# EAGLE design Braille V1 (EAGLE 9.6.2)
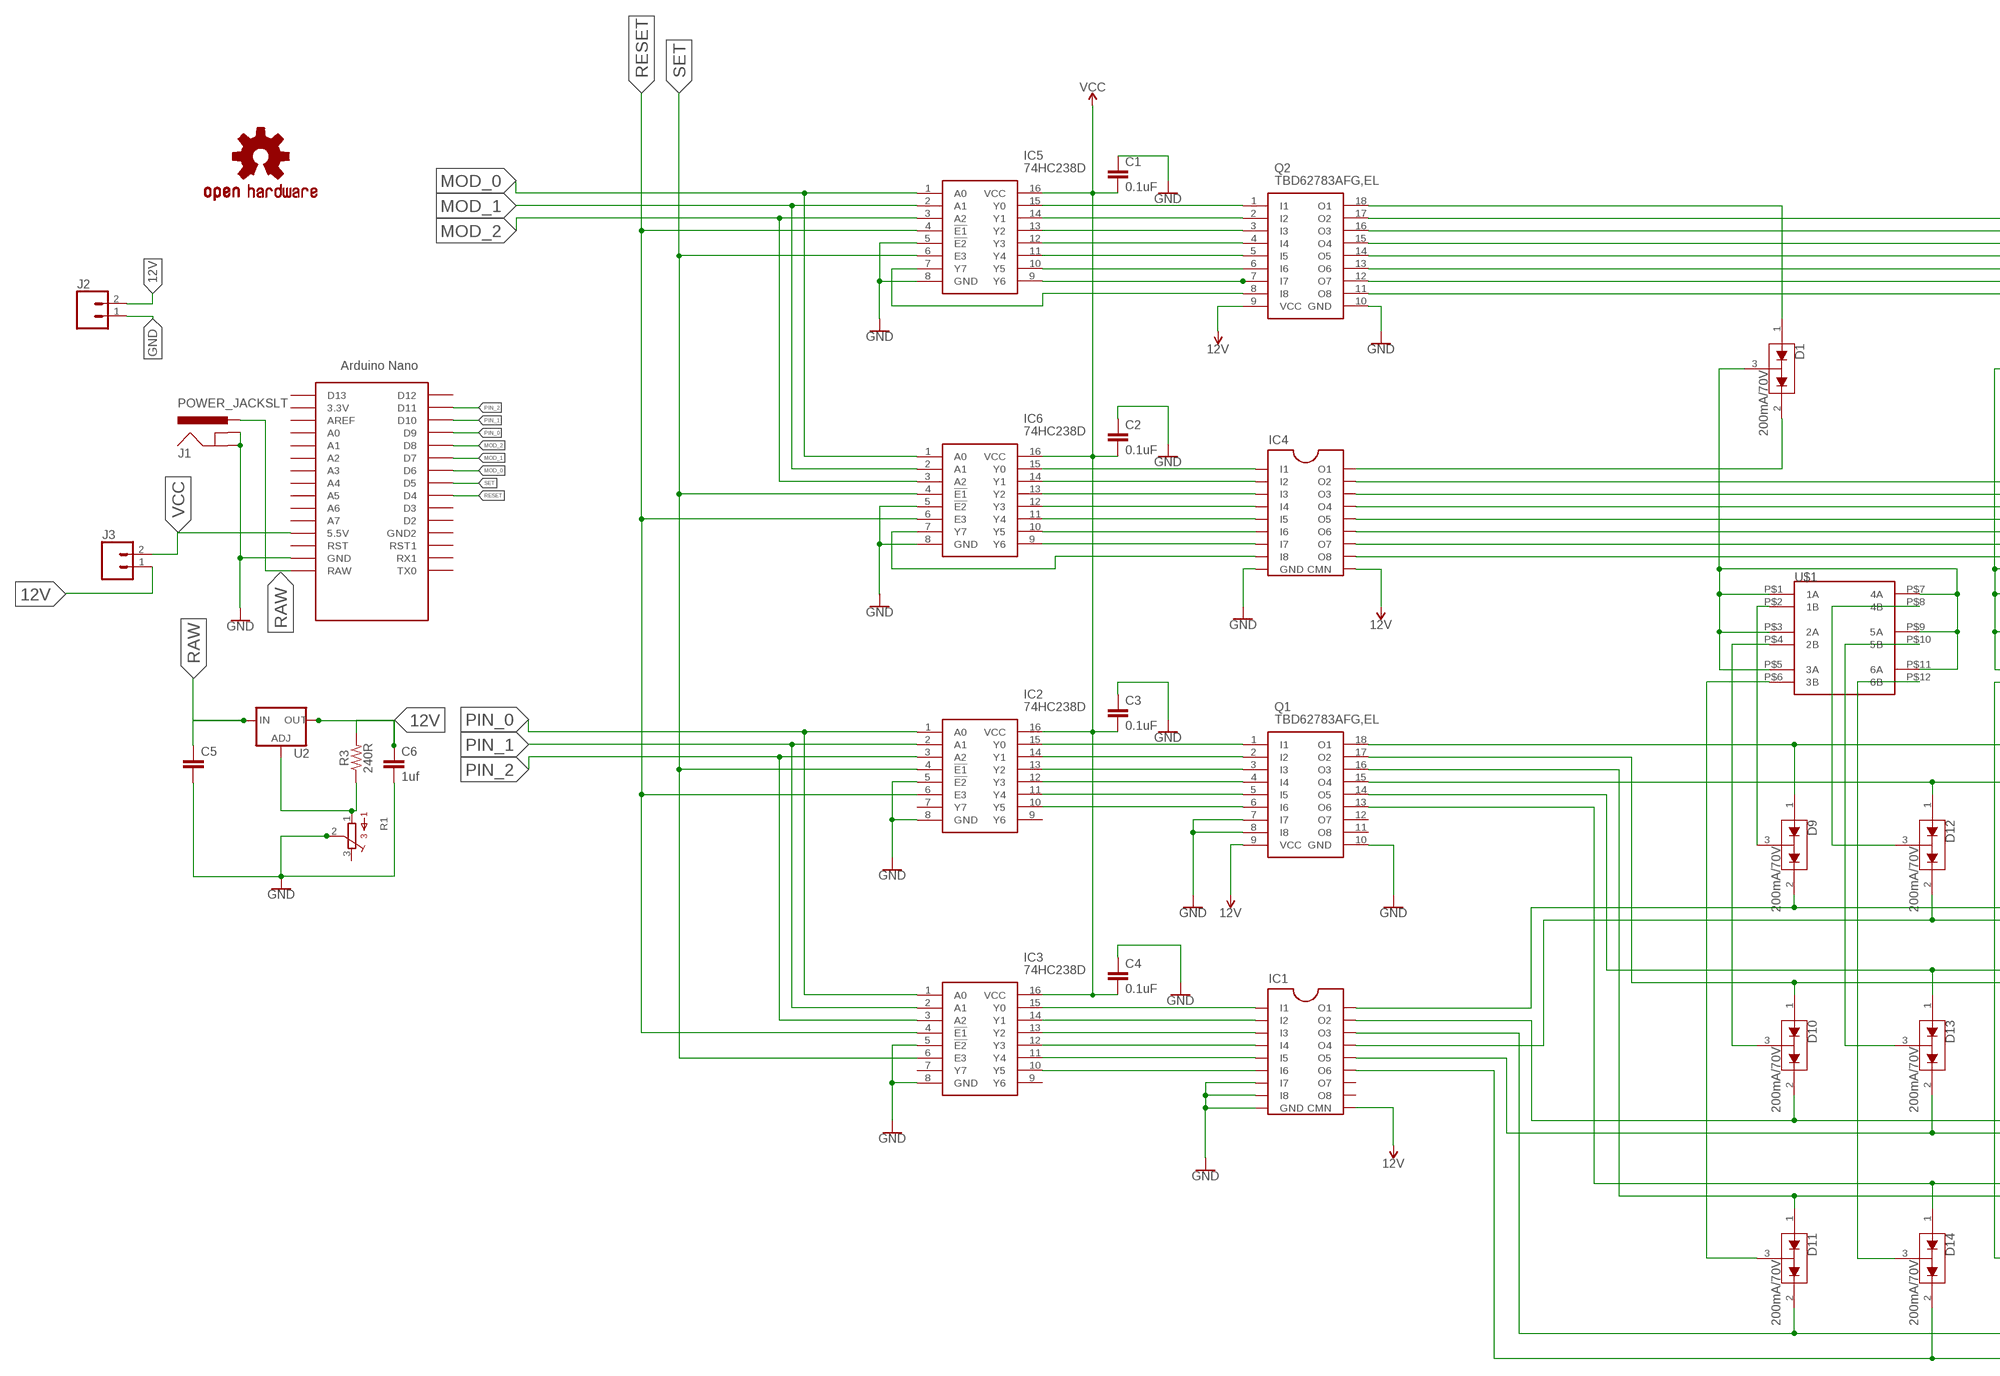
[diagram p0: schematic, sheet 1, part 1 of 2]
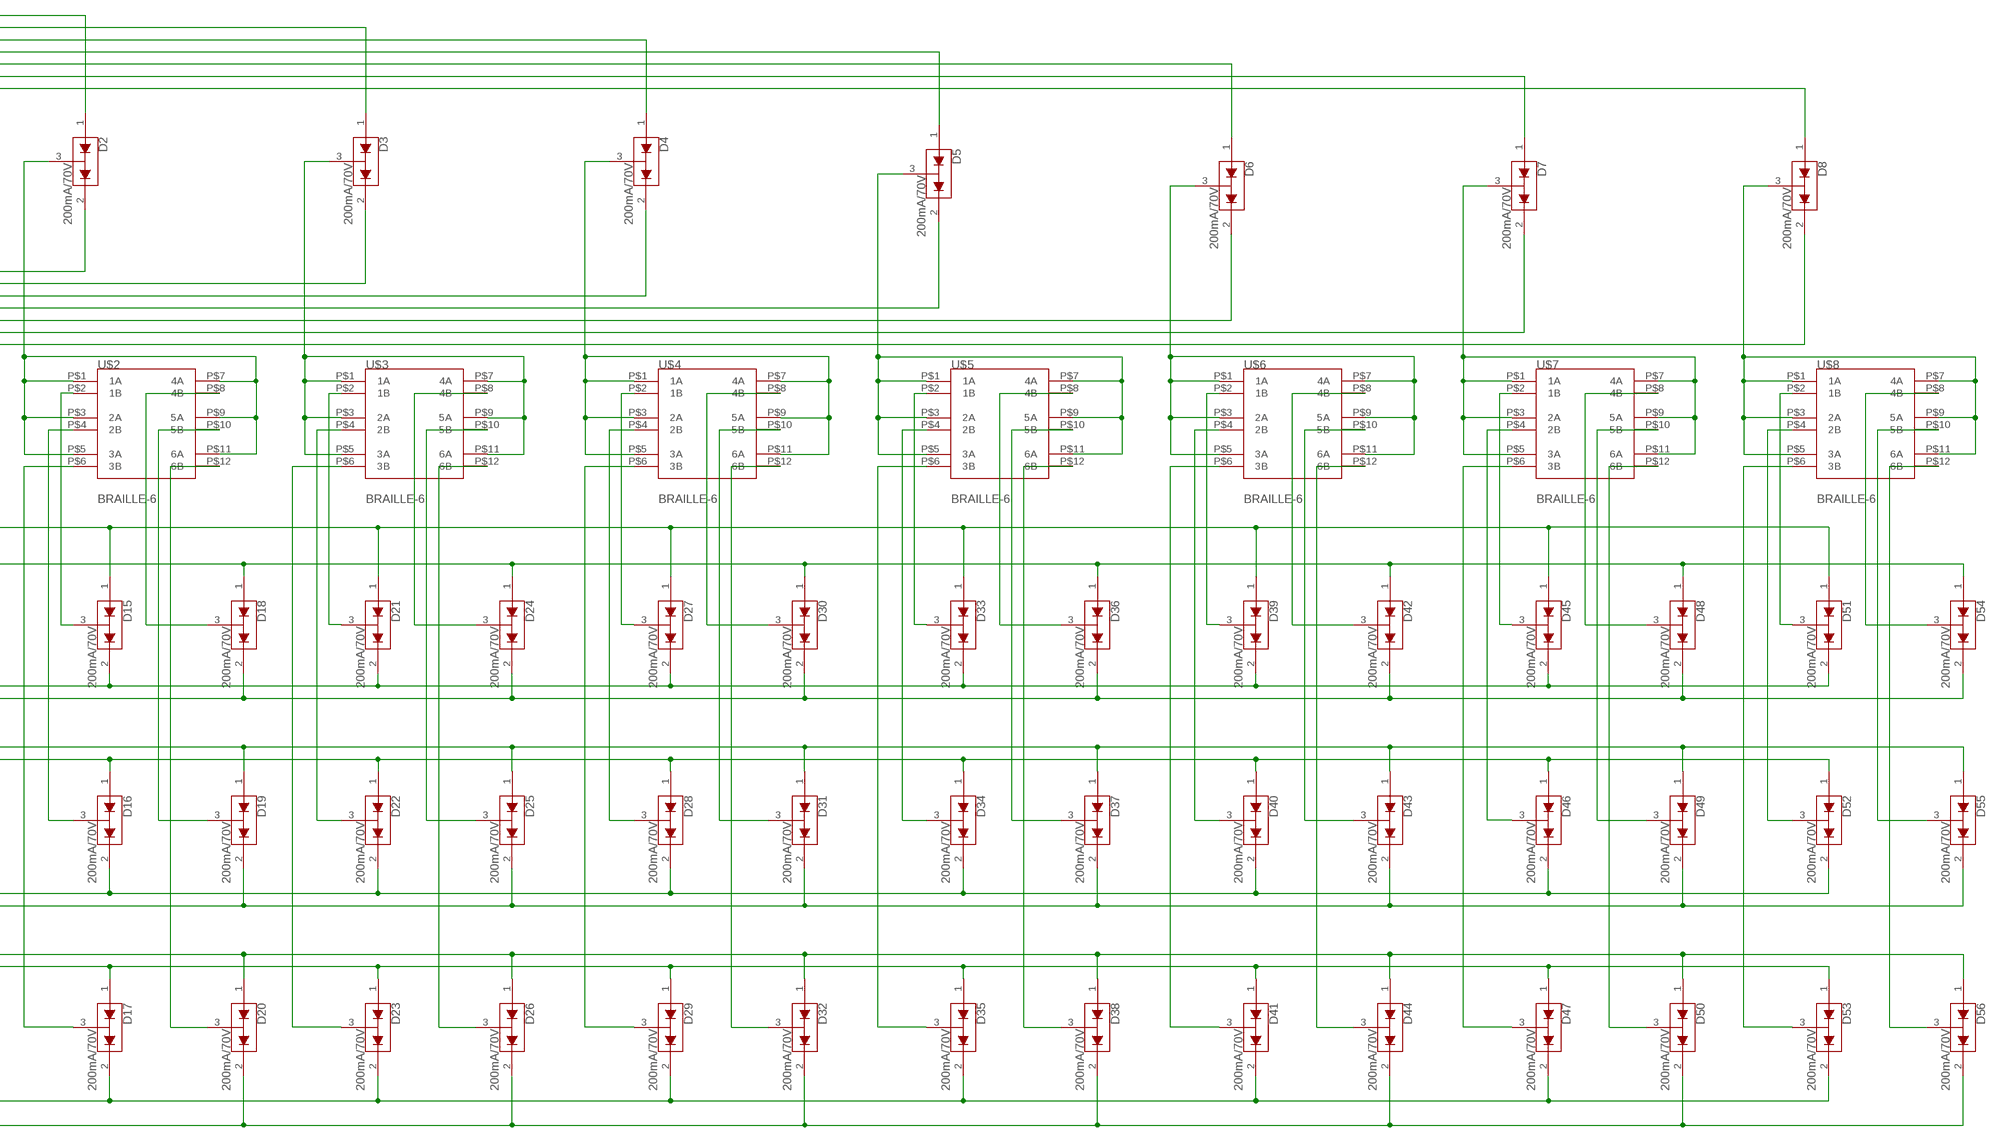
[diagram p1: schematic, sheet 1, part 2 of 2]

## Parts
C1  0.1uF  0.1UF-0603-25V-(+80/-20%)  [0603]
C2  0.1uF  0.1UF-0603-25V-(+80/-20%)  [0603]
C3  0.1uF  0.1UF-0603-25V-(+80/-20%)  [0603]
C4  0.1uF  0.1UF-0603-25V-(+80/-20%)  [0603]
C5  0.1uF  9.0PF-0603-50V-10%  [0603]
C6  1uf  9.0PF-0603-50V-10%  [0603]
D1  200mA/70V  BAV99  [SOT23-3]
D2  200mA/70V  BAV99  [SOT23-3]
D3  200mA/70V  BAV99  [SOT23-3]
D4  200mA/70V  BAV99  [SOT23-3]
D5  200mA/70V  BAV99  [SOT23-3]
D6  200mA/70V  BAV99  [SOT23-3]
D7  200mA/70V  BAV99  [SOT23-3]
D8  200mA/70V  BAV99  [SOT23-3]
D9  200mA/70V  BAV99  [SOT23-3]
D10  200mA/70V  BAV99  [SOT23-3]
D11  200mA/70V  BAV99  [SOT23-3]
D12  200mA/70V  BAV99  [SOT23-3]
D13  200mA/70V  BAV99  [SOT23-3]
D14  200mA/70V  BAV99  [SOT23-3]
D15  200mA/70V  BAV99  [SOT23-3]
D16  200mA/70V  BAV99  [SOT23-3]
D17  200mA/70V  BAV99  [SOT23-3]
D18  200mA/70V  BAV99  [SOT23-3]
D19  200mA/70V  BAV99  [SOT23-3]
D20  200mA/70V  BAV99  [SOT23-3]
D21  200mA/70V  BAV99  [SOT23-3]
D22  200mA/70V  BAV99  [SOT23-3]
D23  200mA/70V  BAV99  [SOT23-3]
D24  200mA/70V  BAV99  [SOT23-3]
D25  200mA/70V  BAV99  [SOT23-3]
D26  200mA/70V  BAV99  [SOT23-3]
D27  200mA/70V  BAV99  [SOT23-3]
D28  200mA/70V  BAV99  [SOT23-3]
D29  200mA/70V  BAV99  [SOT23-3]
D30  200mA/70V  BAV99  [SOT23-3]
D31  200mA/70V  BAV99  [SOT23-3]
D32  200mA/70V  BAV99  [SOT23-3]
D33  200mA/70V  BAV99  [SOT23-3]
D34  200mA/70V  BAV99  [SOT23-3]
D35  200mA/70V  BAV99  [SOT23-3]
D36  200mA/70V  BAV99  [SOT23-3]
D37  200mA/70V  BAV99  [SOT23-3]
D38  200mA/70V  BAV99  [SOT23-3]
D39  200mA/70V  BAV99  [SOT23-3]
D40  200mA/70V  BAV99  [SOT23-3]
D41  200mA/70V  BAV99  [SOT23-3]
D42  200mA/70V  BAV99  [SOT23-3]
D43  200mA/70V  BAV99  [SOT23-3]
D44  200mA/70V  BAV99  [SOT23-3]
D45  200mA/70V  BAV99  [SOT23-3]
D46  200mA/70V  BAV99  [SOT23-3]
D47  200mA/70V  BAV99  [SOT23-3]
D48  200mA/70V  BAV99  [SOT23-3]
D49  200mA/70V  BAV99  [SOT23-3]
D50  200mA/70V  BAV99  [SOT23-3]
D51  200mA/70V  BAV99  [SOT23-3]
D52  200mA/70V  BAV99  [SOT23-3]
D53  200mA/70V  BAV99  [SOT23-3]
D54  200mA/70V  BAV99  [SOT23-3]
D55  200mA/70V  BAV99  [SOT23-3]
D56  200mA/70V  BAV99  [SOT23-3]
IC1  TD62083  [SO18]
IC2  74HC238D  [SOIC127P600X175-16N]
IC3  74HC238D  [SOIC127P600X175-16N]
IC4  TD62083  [SO18]
IC5  74HC238D  [SOIC127P600X175-16N]
IC6  74HC238D  [SOIC127P600X175-16N]
J1  POWER_JACKSLT  [POWER_JACK_SLOT]
J2  CONN_02  [1X02]
J3  CONN_02  [1X02]
LOGO1  OSHW-LOGOL-COPPER  [OSHW-LOGO-L_COPPER]
Q1  TBD62783AFG,EL  [SOIC127P1030X245-18N]
Q2  TBD62783AFG,EL  [SOIC127P1030X245-18N]
R1  3362P  [3362P]
R3  240R  RESISTOR0603  [0603]
U2  LM317  V_REG_317SMD  [SOT223]
U$1  BRAILLE-6  [BRAILLE-6]
U$2  BRAILLE-6  [BRAILLE-6]
U$3  BRAILLE-6  [BRAILLE-6]
U$4  BRAILLE-6  [BRAILLE-6]
U$5  BRAILLE-6  [BRAILLE-6]
U$6  BRAILLE-6  [BRAILLE-6]
U$7  BRAILLE-6  [BRAILLE-6]
U$8  BRAILLE-6  [BRAILLE-6]
U$9  NANO  [NANO]

## Nets
12V: C6.1 IC1.10(CMN) IC4.10(CMN) J2.2 J3.1 Q1.9(VCC) Q2.9(VCC) R3.2 U2.2(OUT)
GND: C1.1 C2.1 C3.1 C4.1 C5.2 C6.2 IC1.7(I7) IC1.8(I8) IC1.9(GND) IC2.5(!E2) IC2.8(GND) IC3.5(!E2) IC3.8(GND) IC4.9(GND) IC5.5(!E2) IC5.8(GND) IC6.5(!E2) IC6.8(GND) J1.GND@1(GNDBREAK) J1.GND@2(GND) J2.1 Q1.7(I7) Q1.8(I8) Q1.10(GND) Q2.10(GND) R1.2 U$9.GND
MOD_0: IC5.1(A0) IC6.1(A0) U$9.D6
MOD_1: IC5.2(A1) IC6.2(A1) U$9.D7
MOD_2: IC5.3(A2) IC6.3(A2) U$9.D8
N$1: IC2.15(Y0) Q1.1(I1)
N$2: IC2.14(Y1) Q1.2(I2)
N$3: IC2.13(Y2) Q1.3(I3)
N$4: IC2.12(Y3) Q1.4(I4)
N$5: IC2.11(Y4) Q1.5(I5)
N$6: IC2.10(Y5) Q1.6(I6)
N$7: IC1.1(I1) IC3.15(Y0)
N$8: IC1.2(I2) IC3.14(Y1)
N$9: IC1.3(I3) IC3.13(Y2)
N$10: IC1.4(I4) IC3.12(Y3)
N$11: IC1.5(I5) IC3.11(Y4)
N$12: IC5.15(Y0) Q2.1(I1)
N$13: IC5.14(Y1) Q2.2(I2)
N$14: IC5.13(Y2) Q2.3(I3)
N$15: IC5.12(Y3) Q2.4(I4)
N$16: IC5.11(Y4) Q2.5(I5)
N$17: D1.1(A1) Q2.18(O1)
N$18: IC4.1(I1) IC6.15(Y0)
N$19: IC4.2(I2) IC6.14(Y1)
N$20: IC4.3(I3) IC6.13(Y2)
N$21: IC4.4(I4) IC6.12(Y3)
N$22: IC4.5(I5) IC6.11(Y4)
N$23: D2.1(A1) Q2.17(O2)
N$24: IC5.10(Y5) Q2.6(I6)
N$25: D3.1(A1) Q2.16(O3)
N$26: IC5.9(Y6) Q2.7(I7)
N$27: IC5.7(Y7) Q2.8(I8)
N$28: IC4.8(I8) IC6.7(Y7)
N$29: IC4.6(I6) IC6.10(Y5)
N$30: IC4.7(I7) IC6.9(Y6)
N$31: D4.1(A1) Q2.15(O4)
N$32: IC1.6(I6) IC3.10(Y5)
N$33: D5.1(A1) Q2.14(O5)
N$34: D6.1(A1) Q2.13(O6)
N$35: D7.1(A1) Q2.12(O7)
N$36: D8.1(A1) Q2.11(O8)
N$37: D1.2(C2) IC4.18(O1)
N$38: D9.3(COM) U$1.P$2(1B)
N$39: D2.2(C2) IC4.17(O2)
N$40: D3.3(COM) U$3.P$1(1A) U$3.P$3(2A) U$3.P$5(3A) U$3.P$7(4A) U$3.P$9(5A) U$3.P$11(6A)
N$41: D4.3(COM) U$4.P$1(1A) U$4.P$3(2A) U$4.P$5(3A) U$4.P$7(4A) U$4.P$9(5A) U$4.P$11(6A)
N$42: D5.3(COM) U$5.P$1(1A) U$5.P$3(2A) U$5.P$5(3A) U$5.P$7(4A) U$5.P$9(5A) U$5.P$11(6A)
N$43: D6.3(COM) U$6.P$1(1A) U$6.P$3(2A) U$6.P$5(3A) U$6.P$7(4A) U$6.P$9(5A) U$6.P$11(6A)
N$44: D7.3(COM) U$7.P$1(1A) U$7.P$3(2A) U$7.P$5(3A) U$7.P$7(4A) U$7.P$9(5A) U$7.P$11(6A)
N$45: D8.3(COM) U$8.P$1(1A) U$8.P$3(2A) U$8.P$5(3A) U$8.P$7(4A) U$8.P$9(5A) U$8.P$11(6A)
N$46: D10.3(COM) U$1.P$4(2B)
N$47: D11.3(COM) U$1.P$6(3B)
N$48: D12.3(COM) U$1.P$8(4B)
N$49: D13.3(COM) U$1.P$10(5B)
N$50: D14.3(COM) U$1.P$12(6B)
N$51: D21.3(COM) U$3.P$2(1B)
N$52: D10.1(A1) D16.1(A1) D22.1(A1) D28.1(A1) D34.1(A1) D40.1(A1) D46.1(A1) D52.1(A1) Q1.17(O2)
N$53: D11.1(A1) D17.1(A1) D23.1(A1) D29.1(A1) D35.1(A1) D41.1(A1) D47.1(A1) D53.1(A1) Q1.16(O3)
N$54: D12.1(A1) D18.1(A1) D24.1(A1) D30.1(A1) D36.1(A1) D42.1(A1) D48.1(A1) D54.1(A1) Q1.15(O4)
N$55: D27.3(COM) U$4.P$2(1B)
N$56: D33.3(COM) U$5.P$2(1B)
N$57: D9.2(C2) D15.2(C2) D21.2(C2) D27.2(C2) D33.2(C2) D39.2(C2) D45.2(C2) D51.2(C2) IC1.18(O1)
N$58: D39.3(COM) U$6.P$2(1B)
N$59: D11.2(C2) D17.2(C2) D23.2(C2) D29.2(C2) D35.2(C2) D41.2(C2) D47.2(C2) D53.2(C2) IC1.16(O3)
N$60: D12.2(C2) D18.2(C2) D24.2(C2) D30.2(C2) D36.2(C2) D42.2(C2) D48.2(C2) D54.2(C2) IC1.15(O4)
N$61: D13.2(C2) D19.2(C2) D25.2(C2) D31.2(C2) D37.2(C2) D43.2(C2) D49.2(C2) D55.2(C2) IC1.14(O5)
N$62: D14.2(C2) D20.2(C2) D26.2(C2) D32.2(C2) D38.2(C2) D44.2(C2) D50.2(C2) D56.2(C2) IC1.13(O6)
N$63: D15.3(COM) U$2.P$2(1B)
N$64: D16.3(COM) U$2.P$4(2B)
N$65: D17.3(COM) U$2.P$6(3B)
N$66: D18.3(COM) U$2.P$8(4B)
N$67: D19.3(COM) U$2.P$10(5B)
N$68: D20.3(COM) U$2.P$12(6B)
N$69: D28.3(COM) U$4.P$4(2B)
N$70: D22.3(COM) U$3.P$4(2B)
N$71: D23.3(COM) U$3.P$6(3B)
N$72: D24.3(COM) U$3.P$8(4B)
N$73: D25.3(COM) U$3.P$10(5B)
N$74: D26.3(COM) U$3.P$12(6B)
N$75: D45.3(COM) U$7.P$2(1B)
N$76: D10.2(C2) D16.2(C2) D22.2(C2) D28.2(C2) D34.2(C2) D40.2(C2) D46.2(C2) D52.2(C2) IC1.17(O2)
N$77: D51.3(COM) U$8.P$2(1B)
N$78: D1.3(COM) U$1.P$1(1A) U$1.P$3(2A) U$1.P$5(3A) U$1.P$7(4A) U$1.P$9(5A) U$1.P$11(6A)
N$79: D2.3(COM) U$2.P$1(1A) U$2.P$3(2A) U$2.P$5(3A) U$2.P$7(4A) U$2.P$9(5A) U$2.P$11(6A)
N$80: D29.3(COM) U$4.P$6(3B)
N$81: D30.3(COM) U$4.P$8(4B)
N$82: D3.2(C2) IC4.16(O3)
N$83: D13.1(A1) D19.1(A1) D25.1(A1) D31.1(A1) D37.1(A1) D43.1(A1) D49.1(A1) D55.1(A1) Q1.14(O5)
N$84: D14.1(A1) D20.1(A1) D26.1(A1) D32.1(A1) D38.1(A1) D44.1(A1) D50.1(A1) D56.1(A1) Q1.13(O6)
N$85: D4.2(C2) IC4.15(O4)
N$86: D5.2(C2) IC4.14(O5)
N$87: D6.2(C2) IC4.13(O6)
N$88: D7.2(C2) IC4.12(O7)
N$89: D8.2(C2) IC4.11(O8)
N$91: D31.3(COM) U$4.P$10(5B)
N$92: D32.3(COM) U$4.P$12(6B)
N$93: R1.1 R3.1 U2.1(ADJ)
N$103: D34.3(COM) U$5.P$4(2B)
N$104: D35.3(COM) U$5.P$6(3B)
N$105: D36.3(COM) U$5.P$8(4B)
N$106: D37.3(COM) U$5.P$10(5B)
N$107: D38.3(COM) U$5.P$12(6B)
N$118: D40.3(COM) U$6.P$4(2B)
N$119: D41.3(COM) U$6.P$6(3B)
N$120: D42.3(COM) U$6.P$8(4B)
N$121: D43.3(COM) U$6.P$10(5B)
N$122: D44.3(COM) U$6.P$12(6B)
N$133: D46.3(COM) U$7.P$4(2B)
N$134: D47.3(COM) U$7.P$6(3B)
N$135: D48.3(COM) U$7.P$8(4B)
N$136: D49.3(COM) U$7.P$10(5B)
N$137: D50.3(COM) U$7.P$12(6B)
N$148: D52.3(COM) U$8.P$4(2B)
N$149: D53.3(COM) U$8.P$6(3B)
N$150: D54.3(COM) U$8.P$8(4B)
N$151: D55.3(COM) U$8.P$10(5B)
N$152: D56.3(COM) U$8.P$12(6B)
N$153: D9.1(A1) D15.1(A1) D21.1(A1) D27.1(A1) D33.1(A1) D39.1(A1) D45.1(A1) D51.1(A1) Q1.18(O1)
PIN_0: IC2.1(A0) IC3.1(A0) U$9.D9
PIN_1: IC2.2(A1) IC3.2(A1) U$9.D10
PIN_2: IC2.3(A2) IC3.3(A2) U$9.D11
RAW: C5.1 J1.PWR U2.3(IN) U$9.RAW
RESET: IC2.6(E3) IC3.4(!E1) IC5.4(!E1) IC6.6(E3) U$9.D4
SET: IC2.4(!E1) IC3.6(E3) IC5.6(E3) IC6.4(!E1) U$9.D5
VCC: C1.2 C2.2 C3.2 C4.2 IC2.16(VCC) IC3.16(VCC) IC5.16(VCC) IC6.16(VCC) J3.2 U$9.5V(5.5V)
Unconnected: IC1.11(O8) IC1.12(O7) IC2.7(Y7) IC2.9(Y6) IC3.7(Y7) IC3.9(Y6) Q1.11(O8) Q1.12(O7) R1.3 U$9.3.3V U$9.A0 U$9.A1 U$9.A2 U$9.A3 U$9.A4 U$9.A5 U$9.A6 U$9.A7 U$9.AREF U$9.D2 U$9.D3 U$9.D12 U$9.D13 U$9.GND1(GND2) U$9.ICSP1 U$9.ICSP2 U$9.ICSP3 U$9.ICSP4 U$9.ICSP5 U$9.ICSP6 U$9.RST U$9.RST1 U$9.RX1 U$9.TX0

## Library data of the parts
C1-C4 = SparkFun-Capacitors:0.1UF: 0.1µF ceramic capacitors A capacitor is a passive two-terminal electrical component used to store electrical energy temporarily in an electric field.; PROD_ID: CAP-00810
C5 C6 = SparkFun-Capacitors:9.0PF: 9.0pF ceramic capacitors A capacitor is a passive two-terminal electrical component used to store electrical energy temporarily in an electric field.; PROD_ID: CAP-09341; VALUE: 9.0pF
D1-D56 = SparkFun-DiscreteSemi:BAV99: Series-pair diode array Two small signal silicon diodes connected anode to cathode. Connections to all three nodes available. Link to datasheet <https://www.fairchildsemi.com/datasheets/BA/BAV99.pdf> SparkFun Products: SparkFun AutoDriver <https://www.sparkfun.com/products/13752>; PROD_ID: DIO-10647
IC1 IC4 = toshiba-td62083:TD62083: 8ch Darlington Sink Driver Source: http://akizukidenshi.com/download/TD62083AP.pdf
IC2 IC3 IC5 IC6 = 74HC238D:74HC238D: Codeurs, dcodeurs, multiplexeurs et dmultiplexeurs 3-TO-8 DECODER DEMULTIPLEXER Source: Datasheet <https://assets.nexperia.com/documents/data-sheet/74HC_HCT238.pdf>; DESCRIPTION: Codeurs, dcodeurs, multiplexeurs et dmultiplexeurs 3-TO-8 DECODER DEMULTIPLEXER; HEIGHT: 1.75mm; MANUFACTURER_NAME: Nexperia; MANUFACTURER_PART_NUMBER: 74HC238D; MOUSER_PART_NUMBER: 771-74HC238D; MOUSER_PRICE-STOCK: https://www.mouser.co.uk/ProductDetail/Nexperia/74HC238D?qs=JTOGeJziEKGZLH3gr9jJBw%3D%3D
J1 = SparkFun-Connectors:POWER_JACK: Power Jack Connector This is the standard 5.5mm barrel jack for power. The PTH is the most common, proven, reliable, footprint. The Slot footprint only works if the mill layer is transmitted to the PCB fab house so be warned. Here are the connectors we sell at SparkFun: DC Barrel Power Jack/Connector <https://www.sparkfun.com/products/119> (PRT-00119) DC Barrel Power Jack/Connector (SMD) <https://www.sparkfun.com/products/12748> (PRT-12748) DC Barrel Jack Adapter - Breadboard Compatible <https://www.sparkfun.com/products/10811> (PRT-10811) It is used on this SparkFun product (and many, many others): SparkFun RedBoard - Programmed with Arduino <https://www.sparkfun.com/products/12757> (DEV-12757) Also, if you need a mating power supply or connector, please check these out: Wall Adapter Power Supply - 9VDC 650mA <https://www.sparkfun.com/products/298> (TOL-00298) DC Barrel Jack Adapter - Male <https://www.sparkfun.com/products/10287> (PRT-10287); PROD_ID: PRT-00119
J2 J3 = SparkFun-Connectors:CONN_02: Multi connection point. Often used as Generic Header-pin footprint for 0.1 inch spaced/style header connections On any of the 0.1 inch spaced packages, you can populate with these: Break Away Headers - Straight <https://www.sparkfun.com/products/116> (PRT-00116) Break Away Male Headers - Right Angle <https://www.sparkfun.com/products/553> (PRT-00553) Female Headers <https://www.sparkfun.com/products/115> (PRT-00115) Break Away Headers - Machine Pin <https://www.sparkfun.com/products/117> (PRT-00117) Break Away Female Headers - Swiss Machine Pin <https://www.sparkfun.com/products/743> (PRT-00743) For SCREWTERMINALS and SPRING TERMINALS visit here: Screw Terimnals on SparkFun.com <https://www.sparkfun.com/search/results?term=Screw+Terminals> (5mm/3.5mm/2.54mm spacing) This device is also useful as a general connection point to wire up your design to another part of your project. Our various solder wires solder well into these plated through hole pads. Hook-Up Wire - Assortment (Stranded, 22 AWG) <https://www.sparkfun.com/products/11375> (PRT-11375) Hook-Up Wire - Assortment (Solid Core, 22 AWG) <https://www.sparkfun.com/products/11367> (PRT-11367) View the entire wire category on our website here <https://www.sparkfun.com/categories/141> Special notes: Molex polarized connector foot print use with: PRT-08233 with associated crimp pins and housings. 2.54_SCREWTERM for use with PRT-10571. 3.5mm Screw Terminal footprints for PRT-08084 5mm Screw Terminal footprints for use with PRT-08432
LOGO1 = SparkFun-Aesthetics:OSHW-LOGO: Open-Source Hardware (OSHW) Logo This logo indicates the piece of hardware it is found on incorporates a OSHW license and/or adheres to the definition of open source hardware found here: http://freedomdefined.org/OSHW
Q1 Q2 = TBD62783AFG_EL:TBD62783AFG,EL: Gate Drivers DMOS Transistor Array8-CH, 50V/0.5A Source: Datasheet; DESCRIPTION: Gate Drivers DMOS Transistor Array8-CH, 50V/0.5A; HEIGHT: 2.45mm; MANUFACTURER_NAME: Toshiba; MANUFACTURER_PART_NUMBER: TBD62783AFG,EL; MOUSER_PART_NUMBER: 757-TBD62783AFGEL; MOUSER_PRICE-STOCK: https://www.mouser.co.uk/ProductDetail/Toshiba/TBD62783AFGEL?qs=fSnNYG2PaKJyPGRf9HI0JA%3D%3D
R1 = bourns:3362: 3362 Series 1/4" Square Trimmer
R3 = SparkFun-Resistors:RESISTOR: Generic Resistor Package
U2 = SparkFun-IC-Power:V_REG_317: Voltage Regulator Standard LM317 adjustable voltage regulator. AOI (Adjust Output Input). Google 'LM317 Calculator' for easy to use app to get the two resistor values needed. 240/720 for 5V output. 240/390 for 3.3V output. Spark Fun Electronics SKU : COM-00527
U$1-U$8 = Braille Cell:BRAILLE-6
U$9 = Arduino-clone:NANO: Arduino Nano

## Board
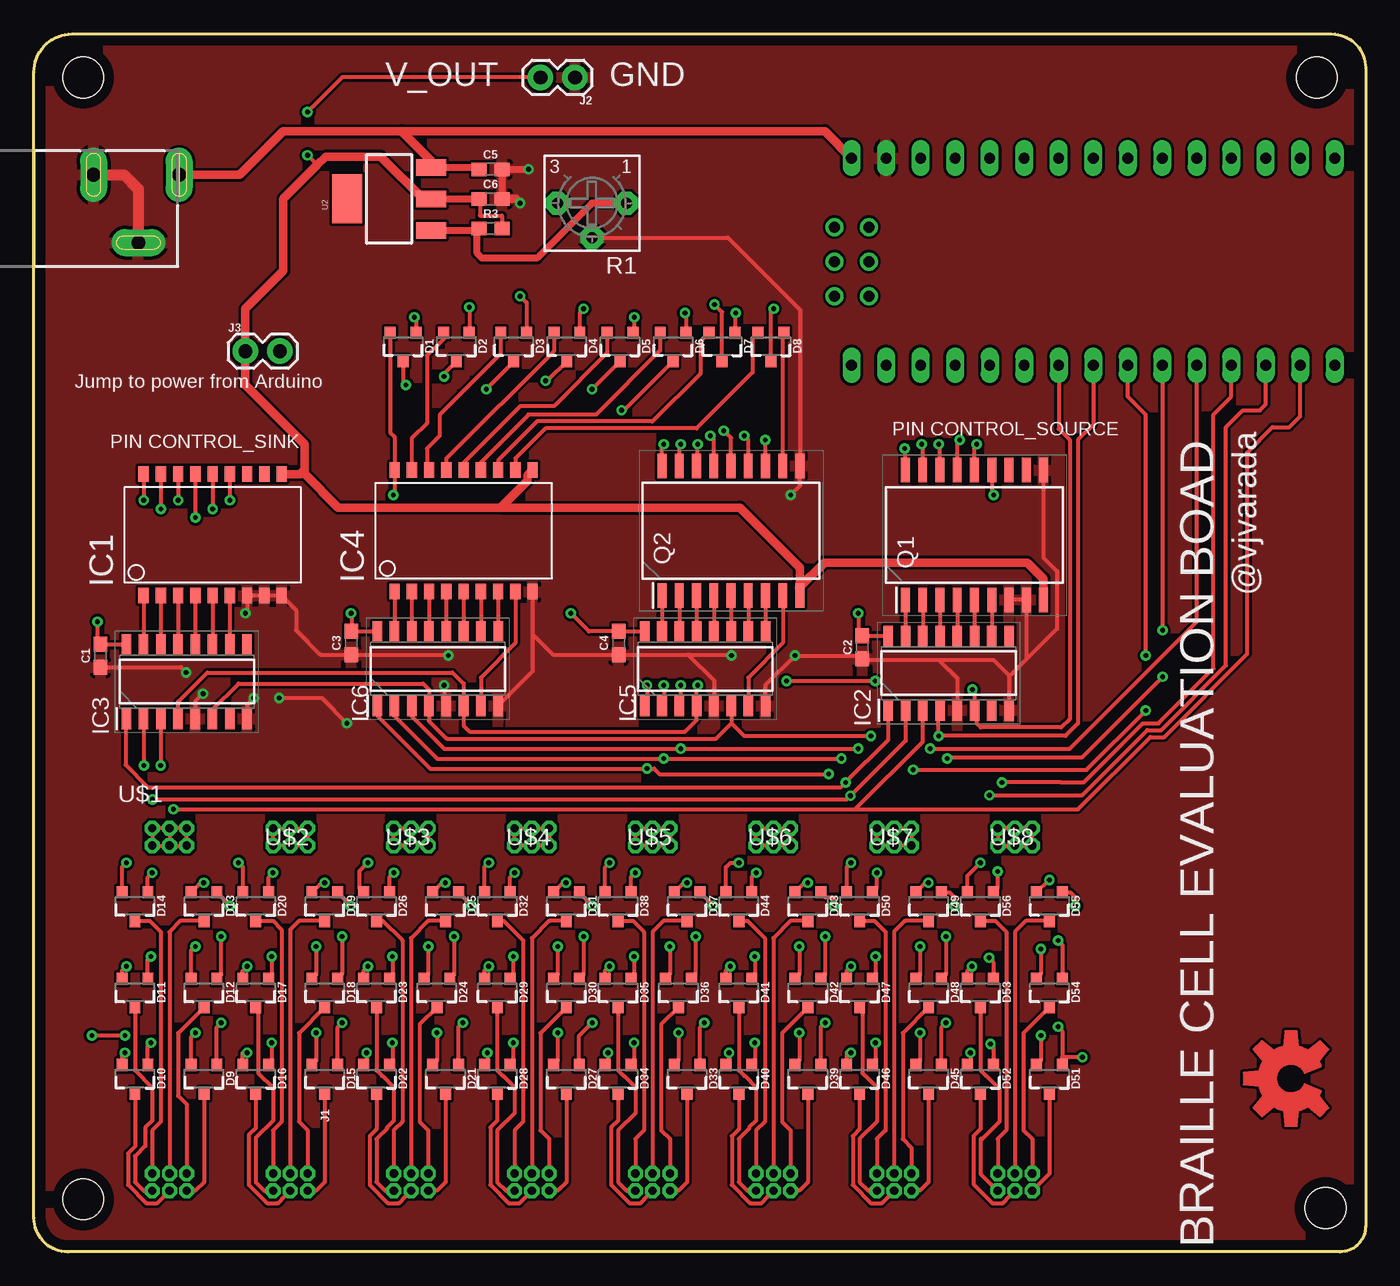
[diagram p2: board, top side]
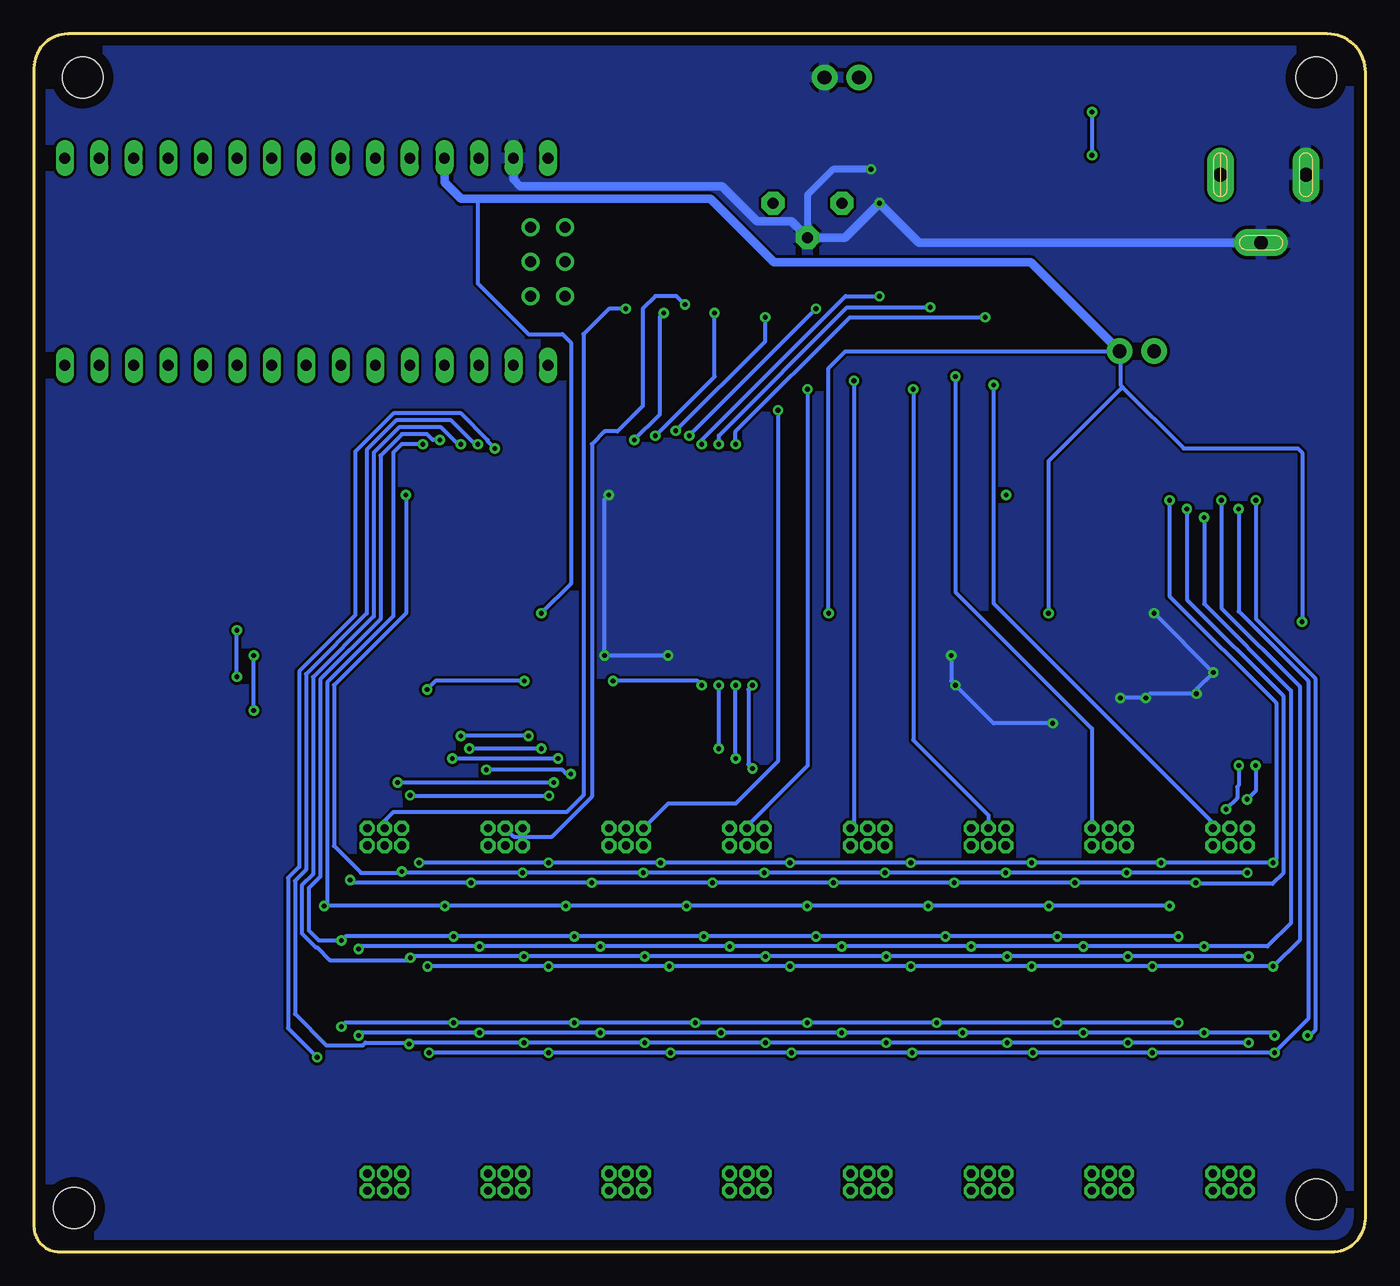
[diagram p3: board, bottom side, seen from below]

Size 98.01 x 89.61 mm. Coordinates in mm from the lower left corner, seen from the top.
Outline: 2.8,89.61 95.52,89.61 arc-90 98.01,87.12 98.01,1.87 arc-90 96.15,0 2.49,0 arc-90 0,2.49 0,86.81 arc-90 2.8,89.61
Copper layers (1*16): Top 0.035mm / dielectric 1.5mm / Bottom 0.035mm
Design rules "LionCircuits": minimum track width 8mil, minimum drill 0.35mm, track to track 8mil, track to pad 8mil, pad to pad 8mil, via to via 8mil, smd to smd 8mil, copper to edge 30mil, drill to drill 10mil, minimum pad ring 10mil, minimum via ring 8mil, stop-mask expansion 4mil, vias tented up to drill 0mil, thermal gap 10mil
Holes 3 mm at 3.63,86.41 3.63,3.86 95.07,3.23 94.43,86.41

### Footprints (pad centres in the part's own frame; a part is rotated, then mirrored left to right if it is on the bottom)
0603 = smd 1.1 x 1: 1 -0.85,0; 2 0.85,0
SOT23-3 = smd 0.8 x 0.9: 1 -0.95,-1; 2 0.95,-1; 3 0,1.1
SO18 = smd 0.762 x 1.143: 1 -5.08,-3.835; 2 -3.81,-3.835; 3 -2.54,-3.835; 4 -1.27,-3.835; 5 0,-3.835; 6 1.27,-3.835; 7 2.54,-3.835; 8 3.81,-3.835; 9 5.08,-3.835; 10 5.08,5.105; 11 3.81,5.105; 12 2.54,5.105; 13 1.27,5.105; 14 0,5.105; 15 -1.27,5.105; 16 -2.54,5.105; 17 -3.81,5.105; 18 -5.08,5.105
SOIC127P600X175-16N = smd 1.55 x 0.7: 1 -2.725,4.445; 2 -2.725,3.175; 3 -2.725,1.905; 4 -2.725,0.635; 5 -2.725,-0.635; 6 -2.725,-1.905; 7 -2.725,-3.175; 8 -2.725,-4.445; 9 2.725,-4.445; 10 2.725,-3.175; 11 2.725,-1.905; 12 2.725,-0.635; 13 2.725,0.635; 14 2.725,1.905; 15 2.725,3.175; 16 2.725,4.445
POWER_JACK_SLOT = drill 1 pad 2 long: GND@1 2.58,7.5; GND@2 7.58,10.8; PWR 2.58,13.8
1X02 = drill 1.016 pad 1.88: 1 0,0; 2 2.54,0
SOIC127P1030X245-18N = smd 1.8 x 0.65: 1 -4.775,5.08; 2 -4.775,3.81; 3 -4.775,2.54; 4 -4.775,1.27; 5 -4.775,0; 6 -4.775,-1.27; 7 -4.775,-2.54; 8 -4.775,-3.81; 9 -4.775,-5.08; 10 4.775,-5.08; 11 4.775,-3.81; 12 4.775,-2.54; 13 4.775,-1.27; 14 4.775,0; 15 4.775,1.27; 16 4.775,2.54; 17 4.775,3.81; 18 4.775,5.08
3362P = drill 0.813 pad 1.676 octagon: 1 -2.54,0; 2 0,2.54; 3 2.54,0
SOT223 = smd 1.219 x 2.235: 1 -2.311,-3.099; 2 0,-3.099; 3 2.311,-3.099 | smd 3.6 x 2.2: 4 0,3.099
BRAILLE-6 = drill 0.6 octagon: P$1 -1.27,13.335; P$2 1.27,-13.335; P$3 0,13.335; P$4 0,-13.335; P$5 1.27,13.335; P$6 -1.27,-13.335; P$7 -1.27,12.065; P$8 1.27,-12.065; P$9 0,12.065; P$10 0,-12.065; P$11 1.27,12.065; P$12 -1.27,-12.065
NANO = drill 0.8 long: 3.3V -10.16,24.13; 5V -10.16,-1.27; A0 -10.16,19.05; A1 -10.16,16.51; A2 -10.16,13.97; A3 -10.16,11.43; A4 -10.16,8.89; A5 -10.16,6.35; A6 -10.16,3.81; A7 -10.16,1.27; AREF -10.16,21.59; D2 5.08,1.27; D3 5.08,3.81; D4 5.08,6.35; D5 5.08,8.89; D6 5.08,11.43; D7 5.08,13.97; D8 5.08,16.51; D9 5.08,19.05; D10 5.08,21.59; D11 5.08,24.13; D12 5.08,26.67; D13 -10.16,26.67; GND -10.16,-6.35; GND1 5.08,-1.27; RAW -10.16,-8.89; RST -10.16,-3.81; RST1 5.08,-3.81; RX1 5.08,-6.35; TX0 5.08,-8.89 | drill 0.8: ICSP1 -5.08,-10.16; ICSP2 -5.08,-7.62; ICSP3 -2.54,-10.16; ICSP4 -2.54,-7.62; ICSP5 0,-10.16; ICSP6 0,-7.62

### Placement (x,y rotation side)
C1  4.9,43.87 90 top
C2  60.97,44.49 90 top
C3  23.36,44.8 90 top
C4  43.04,44.8 90 top
C5  33.6,79.65 0 top
C6  33.6,77.48 0 top
D1  27.18,66.64 180 top
D2  31.09,66.64 180 top
D3  35.31,66.64 180 top
D4  39.22,66.64 180 top
D5  43.14,66.64 180 top
D6  47.05,66.64 180 top
D7  50.65,66.64 180 top
D8  54.25,66.64 180 top
D9  12.52,12.75 180 top
D10  7.44,12.75 180 top
D11  7.44,19.1 180 top
D12  12.52,19.1 180 top
D13  12.52,25.45 180 top
D14  7.44,25.45 180 top
D15  21.41,12.75 180 top
D16  16.33,12.75 180 top
D17  16.33,19.1 180 top
D18  21.41,19.1 180 top
D19  21.41,25.45 180 top
D20  16.33,25.45 180 top
D21  30.3,12.75 180 top
D22  25.22,12.75 180 top
D23  25.22,19.1 180 top
D24  29.66,19.1 180 top
D25  30.3,25.45 180 top
D26  25.22,25.45 180 top
D27  39.19,12.75 180 top
D28  34.11,12.75 180 top
D29  34.11,19.1 180 top
D30  39.19,19.1 180 top
D31  39.19,25.45 180 top
D32  34.11,25.45 180 top
D33  48.08,12.75 180 top
D34  43,12.75 180 top
D35  43,19.1 180 top
D36  47.44,19.1 180 top
D37  48.08,25.45 180 top
D38  43,25.45 180 top
D39  56.97,12.75 180 top
D40  51.89,12.75 180 top
D41  51.89,19.1 180 top
D42  56.97,19.1 180 top
D43  56.97,25.45 180 top
D44  51.89,25.45 180 top
D45  65.86,12.75 180 top
D46  60.78,12.75 180 top
D47  60.78,19.1 180 top
D48  65.86,19.1 180 top
D49  65.86,25.45 180 top
D50  60.78,25.45 180 top
D51  74.75,12.75 180 top
D52  69.67,12.75 180 top
D53  69.67,19.1 180 top
D54  74.75,19.1 180 top
D55  74.75,25.45 180 top
D56  69.67,25.45 180 top
IC1  13.15,52.12 0 top
IC2  67.32,42.58 90 top
IC3  11.25,41.96 90 top
IC4  31.62,52.42 0 top
IC5  49.4,42.89 90 top
IC6  29.72,42.89 90 top
J1  -3.11,81.83 270 top
J2  39.82,86.41 180 top
J3  15.56,66.27 0 top
LOGO1  92.53,12.75 90 top
Q1  69.23,52.74 90 top
Q2  51.31,53.05 90 top
R1  41.07,77.17 180 top
R3  33.6,75.3 0 top
U2  26.14,77.48 90 top
U$1  9.98,17.83 0 top
U$2  18.87,17.83 0 top
U$3  27.76,17.83 0 top
U$4  36.65,17.83 0 top
U$5  45.54,17.83 0 top
U$6  54.43,17.83 0 top
U$7  63.32,17.83 0 top
U$8  72.21,17.83 0 top
U$9  69.08,70.32 270 top

### Tracks (layer width: path | path; a pad name or v marks a point on that pad's centre or on a via)
12V  (via drill 0.35)
  Top 0.305: 56.39,48.95 Q2.9 56.39,48.85 56.32,48.85 | C6.1 32.84,77.48 32.84,76.25 34.45,76.25 R3.2 | J2.2 22.68,86.41 v20.14,83.87 | v20.14,80.7 20.86,79.97
  Top 0.508: U2.2 C6.1
  Top 0.61: 19.91,57.56 19.58,57.23 IC1.10 | U2.2 28.63,77.48 25.51,80.59 21.47,80.59 20.86,79.97 18.36,77.48 18.36,72.19 15.56,69.39 J3.1 15.56,63.79 19.91,59.43 19.91,57.56 | IC4.10 36.32,57.14 36.32,56.74 34.34,54.76 | 19.91,57.56 19.91,57.25 22.4,54.76 34.34,54.76 | 34.34,54.76 51.96,54.76 56.39,50.34 56.39,48.95 | Q1.9 74.31,49.53 73.12,50.72 58.18,50.72 56.32,48.85
  Bottom 0.305: v20.14,83.87 v20.14,80.7
GND  (via drill 0.35)
  Top 0.305: 66.59,43.56 61.05,43.56 C2.1 60.74,43.87 v56.01,43.87 53.85,41.71 IC5.8 | 66.59,43.56 67.96,42.19 IC2.5 | 66.59,43.56 70.63,43.56 71.77,42.42 71.77,42.32 | 71.77,42.32 IC2.8 | 73.04,43.59 Q1.8 Q1.7 | 73.04,43.59 71.77,42.32 | 48.15,43.95 C4.1 38.19,43.95 36.72,45.43 | IC5.5 50.04,42.06 48.15,43.95 | IC4.9 36.72,45.43 | 36.72,45.43 36.72,42.72 IC6.8 | v30.49,43.87 30.42,43.95 C3.1 21.08,43.95 19.29,45.74 19.29,47.22 IC1.9 IC1.8 IC1.7 15.69,47.12 v15.56,46.98 | v30.18,41.69 30.18,40.34 IC6.5 | C1.1 10.81,43.02 v11.2,42.63 | v12.45,41.07 11.88,40.51 IC3.5 | v16.18,40.76 15.69,40.27 IC3.8 | v18.05,40.76 21.16,40.76 v23.02,38.89 | 48.15,43.95 51.26,43.95 v51.34,43.87 | 74.31,56.88 Q1.10 74.31,51.09 75.3,50.09 75.3,45.85 73.04,43.59 | v55.7,55.7 56.39,56.39 Q2.10 56.39,69.32 51.08,74.62 R1.2
  Top 0.508: C6.2 C5.2 v36.4,79.65 | J1.GND@2 7.69,75.89 | 5.69,79.25 J1.GND@1
  Top 0.61: C6.2 35.47,77.48 v35.78,77.16
  Top 0.813: J1.GND@1 6.62,79.25 7.69,78.19 J1.GND@2
  Bottom 0.305: v30.49,43.87 30.49,42 v30.18,41.69 27.38,38.89 v23.02,38.89 | v15.56,46.98 v11.2,42.63 12.45,41.38 v12.45,41.07 15.87,41.07 v16.18,40.76 v18.05,40.76 | v51.34,43.87 v56.01,43.87 56.01,55.38 v55.7,55.7
  Bottom 0.508: v36.4,79.65 39.2,79.65 41.07,77.79 R1.2
  Bottom 0.61: J1.GND@2 32.87,74.25 v35.78,77.16 38.32,74.62 R1.2 42.27,75.82 44.79,75.82 47.38,78.41 62.23,78.41 62.72,78.9 U$9.GND
  pour Top: -0.18,90.22 98.24,90.22 98.24,-0.58 -0.18,-0.58
  pour Bottom: -0.18,90.22 98.24,90.22 98.24,-0.58 -0.18,-0.58
MOD_0  (via drill 0.35)
  Top 0.305: IC6.1 25.27,39.45 29.16,35.56 v45.12,35.56 45.65,35.56 46.05,35.16 v58.5,35.16 | v45.12,41.69 45.12,40.33 IC5.1 | v81.83,39.83 77.48,35.47 v64.72,35.47 | v81.83,43.87 81.83,61.61 80.5,62.93 U$9.D6
  Bottom 0.305: v45.12,35.56 45.43,35.87 45.43,41.38 v45.12,41.69 | v58.5,35.16 58.81,35.16 59.12,35.47 v64.72,35.47 | v81.83,39.83 v81.83,43.87
MOD_1  (via drill 0.35)
  Top 0.305: IC6.2 26.54,39.42 29.67,36.29 v46.36,36.29 v59.43,36.29 | v46.36,41.69 46.36,40.3 IC5.2 | v67.21,36.29 67.21,36.4 77.16,36.4 v83.08,42.32 | v83.08,45.74 83.08,65.21 U$9.D7
  Bottom 0.305: v46.36,36.29 v46.36,41.69 | v59.43,36.29 v67.21,36.29 | v83.08,42.32 v83.08,45.74
MOD_2  (via drill 0.35)
  Top 0.305: IC6.3 27.81,39.4 30.18,37.03 v47.61,37.03 v60.67,37.03 | v47.61,41.69 47.61,40.28 IC5.3 | v65.96,37.03 76.23,37.03 85.58,46.38 U$9.D8
  Bottom 0.305: v47.61,37.03 v47.61,41.69 | v60.67,37.03 v65.96,37.03
N$1
  Top 0.305: Q1.1 IC2.15
N$2
  Top 0.305: Q1.2 IC2.14
N$3
  Top 0.305: Q1.3 IC2.13
N$4
  Top 0.305: Q1.4 IC2.12
N$5
  Top 0.305: Q1.5 IC2.11
N$6
  Top 0.305: Q1.6 IC2.10
N$7
  Top 0.305: IC1.1 IC3.15
N$8
  Top 0.305: IC1.2 IC3.14
N$9
  Top 0.305: IC1.3 IC3.13
N$10
  Top 0.305: IC1.4 IC3.12
N$11
  Top 0.305: IC1.5 IC3.11
N$12
  Top 0.305: Q2.1 IC5.15
N$13
  Top 0.305: Q2.2 IC5.14
N$14
  Top 0.305: Q2.3 IC5.13
N$15
  Top 0.305: Q2.4 IC5.12
N$16
  Top 0.305: Q2.5 IC5.11
N$17  (via drill 0.35)
  Top 0.305: Q2.18 46.23,59.3 v46.36,59.43 | v28,68.76 28.13,68.64 D1.1
  Bottom 0.305: v28,68.76 37.96,68.76 46.36,60.36 v46.36,59.43
N$18
  Top 0.305: IC4.1 IC6.15
N$19
  Top 0.305: IC4.2 IC6.14
N$20
  Top 0.305: IC4.3 IC6.13
N$21
  Top 0.305: IC4.4 IC6.12
N$22
  Top 0.305: IC4.5 IC6.11
N$23  (via drill 0.35)
  Top 0.305: Q2.17 47.5,59.32 v47.61,59.43 | v32.05,69.5 32.05,67.65 D2.1
  Bottom 0.305: v47.61,59.43 47.61,60.05 38.16,69.5 v32.05,69.5
N$24
  Top 0.305: Q2.6 IC5.10
N$25  (via drill 0.35)
  Top 0.305: Q2.16 48.85,57.91 v48.85,59.43 | v35.78,70.32 36.26,69.84 D3.1
  Bottom 0.305: v48.85,59.43 48.85,59.74 38.27,70.32 v35.78,70.32
N$26
  Top 0.305: Q2.7 IC5.9
N$27
  Top 0.305: Q2.8 55.12,44.8 52.58,42.26 IC5.7
N$28
  Top 0.305: IC4.8 35.43,44.8 32.89,42.26 IC6.7
N$29
  Top 0.305: IC4.6 IC6.10
N$30
  Top 0.305: IC4.7 IC6.9
N$31  (via drill 0.35)
  Top 0.305: Q2.15 50.04,59.8 v49.78,60.05 | v40.45,69.39 40.17,69.11 D4.1
  Bottom 0.305: v49.78,60.05 v40.45,69.39
N$32
  Top 0.305: IC1.6 IC3.10
N$33  (via drill 0.35)
  Top 0.305: Q2.14 51.31,59.88 v50.77,60.42 | v44.18,68.76 44.18,67.73 D5.1
  Bottom 0.305: v50.77,60.42 44.18,67.01 v44.18,68.76
N$34  (via drill 0.35)
  Top 0.305: Q2.13 52.58,59.75 v52.27,60.05 | v47.92,69.07 48,68.99 D6.1
  Bottom 0.305: v52.27,60.05 47.92,64.41 v47.92,69.07
N$35  (via drill 0.35)
  Top 0.305: Q2.12 53.83,57.85 v53.83,59.74 | v51.65,69.07 51.6,69.02 D7.1
  Bottom 0.305: v53.83,59.74 51.96,61.61 51.96,68.76 v51.65,69.07
N$36
  Top 0.305: Q2.11 55.12,67.56 D8.1
N$37  (via drill 0.35)
  Top 0.305: v26.45,55.7 26.54,55.79 IC4.18 26.54,59.96 26.23,60.27 D1.2
N$38
  Top 0.305: D9.3 12.52,5.13 11.88,4.5 U$1.P$2
N$39
  Top 0.305: D2.2 30.14,67.17 28.94,65.96 28.94,60.99 27.81,59.86 IC4.17
N$40  (via drill 0.35)
  Top 0.305: U$3.P$3 U$3.P$1 U$3.P$7 U$3.P$9 | U$3.P$3 U$3.P$5 U$3.P$11 | U$3.P$11 U$3.P$9 | U$3.P$3 U$3.P$9 | U$3.P$11 29.2,30.07 | D3.3 35.31,65.49 v33.29,63.47
  Bottom 0.305: v33.29,63.47 33.29,37.65 27.76,32.11 U$3.P$3
N$41  (via drill 0.35)
  Top 0.305: U$4.P$3 U$4.P$1 U$4.P$7 U$4.P$9 | U$4.P$3 U$4.P$5 U$4.P$11 U$4.P$9 | U$4.P$3 U$4.P$9 | D4.3 37.78,64.1 v37.65,64.1
  Bottom 0.305: v37.65,64.1 37.65,31.43 U$4.P$5
N$42  (via drill 0.35)
  Top 0.305: U$5.P$3 U$5.P$1 U$5.P$7 U$5.P$9 | U$5.P$3 U$5.P$5 U$5.P$11 | U$5.P$11 U$5.P$9 | U$5.P$3 U$5.P$9 | U$5.P$11 46.98,30.07 | D5.3 v41.07,63.47
  Bottom 0.305: v41.07,63.47 41.07,35.78 45.54,31.32 U$5.P$3
N$43  (via drill 0.35)
  Top 0.305: U$6.P$11 U$6.P$5 U$6.P$3 U$6.P$1 U$6.P$7 U$6.P$9 U$6.P$11 | U$6.P$11 55.87,30.07 | D6.3 43.43,61.92 v43.25,61.92
  Bottom 0.305: v43.25,61.92 43.25,36.09 46.36,32.98 51.34,32.98 U$6.P$1
N$44  (via drill 0.35)
  Top 0.305: U$7.P$11 U$7.P$5 U$7.P$3 U$7.P$1 U$7.P$7 U$7.P$9 U$7.P$11 | U$7.P$11 64.76,30.07 | D7.3 50.65,69.14 v50.09,69.7
  Bottom 0.305: v50.09,69.7 50.72,70.32 52.27,70.32 53.21,69.39 53.21,62.23 55.07,60.36 56.01,60.36 56.94,59.43 56.94,33.5 59.89,30.54 62.69,30.54 U$7.P$3
N$45  (via drill 0.35)
  Top 0.305: U$8.P$11 U$8.P$9 U$8.P$7 U$8.P$1 U$8.P$3 U$8.P$5 U$8.P$11 | U$8.P$11 73.65,30.07 | D8.3 54.25,69.18 v54.45,69.39
  Bottom 0.305: v54.45,69.39 55.7,69.39 57.56,67.52 57.56,33.6 58.81,32.36 71.56,32.36 72.21,31.72 U$8.P$3
N$46
  Top 0.305: D10.3 7.44,7.75 6.93,7.25 6.93,4.92 8.26,3.59 9.08,3.59 9.62,4.12 9.62,4.14 U$1.P$4
N$47
  Top 0.305: D11.3 7.44,13.35 8.71,12.08 8.71,9.66 8.2,9.15 8.2,7.8 7.44,7.04 7.44,5.13 8.07,4.5 U$1.P$6
N$48
  Top 0.305: D12.3 10.61,16.1 10.61,11.48 11.25,10.85 U$1.P$8
N$49
  Top 0.305: U$1.P$10 9.98,23.55 10.78,24.35 D13.3
N$50
  Top 0.305: D14.3 8.54,24.35 9.34,23.55 9.34,9.58 8.71,8.94 U$1.P$12
N$51
  Top 0.305: D21.3 30.3,5.13 29.66,4.5 U$3.P$2
N$52  (via drill 0.35)
  Top 0.305: D10.1 8.39,15.17 v8.61,15.39 | v70.4,15.29 70.62,15.07 D52.1 | v61.95,15.39 61.95,13.97 D46.1 | v53.06,15.39 53.06,13.97 D40.1 | v44.17,15.39 44.17,13.97 D34.1 | v26.39,15.39 26.39,13.97 D22.1 | v35.28,15.39 35.28,13.97 D28.1 | v17.5,15.39 17.5,13.97 D16.1 | Q1.17 65.42,59.35 v65.34,59.43
  Bottom 0.305: v8.61,15.39 v17.5,15.39 v26.39,15.39 | 26.49,15.29 v26.39,15.39 | v26.39,15.39 v35.28,15.39 v44.17,15.39 v53.06,15.39 v61.95,15.39 70.3,15.39 | 70.3,15.39 v70.4,15.29 | v65.34,59.43 65.55,59.43 67.3,61.18 71.35,61.18 73.51,59.01 73.51,46.97 77.98,42.5 77.98,28.12 78.8,27.3 78.8,17.51 76.49,15.19 73.81,15.19 73.61,15.39 70.3,15.39
N$53  (via drill 0.35)
  Top 0.305: D11.1 8.39,21.52 v8.61,21.74 | v70.3,21.64 70.62,21.33 D53.1 | v61.95,21.74 61.95,20.32 D47.1 | v53.06,21.74 53.06,20.32 D41.1 | v44.17,21.74 44.17,20.32 D35.1 | v35.28,21.74 35.28,20.32 D29.1 | v26.39,21.74 26.39,20.32 D23.1 | v17.5,21.74 17.5,20.32 D17.1 | Q1.16 66.69,59.33 v66.59,59.43
  Bottom 0.305: v8.61,21.74 v17.5,21.74 v26.39,21.74 v35.28,21.74 v44.17,21.74 v53.06,21.74 v61.95,21.74 70.2,21.74 v70.3,21.64 70.47,21.47 76.23,21.47 77.16,22.4 77.26,22.4 78.3,23.44 78.3,26.97 77.48,27.79 77.48,42.29 73.01,46.76 73.01,58.8 71.14,60.67 68.03,60.67 66.79,59.43 v66.59,59.43
N$54  (via drill 0.35)
  Top 0.305: D12.1 13.79,20.42 v13.79,23.21 | v75.38,22.91 75.7,22.6 D54.1 | v67.13,23.21 67.13,20.42 D48.1 | v58.24,23.21 58.24,20.42 D42.1 | v48.71,23.21 48.71,20.42 D36.1 | v40.46,23.21 40.46,20.42 D30.1 | v30.93,23.21 30.93,20.42 D24.1 | v22.68,23.21 22.68,20.42 D18.1 | Q1.15 67.96,59.56 v68.14,59.74
  Bottom 0.305: v13.79,23.21 v22.68,23.21 v30.93,23.21 v40.46,23.21 v48.71,23.21 v58.24,23.21 v67.13,23.21 75.08,23.21 v75.38,22.91 77.05,22.91 77.79,23.65 77.79,26.76 76.94,27.61 76.94,42.11 72.5,46.55 72.5,58.59 70.93,60.16 69.08,60.16 68.66,59.74 v68.14,59.74
N$55
  Top 0.305: D27.3 39.19,5.13 38.55,4.5 U$4.P$2
N$56
  Top 0.305: D33.3 48.08,5.13 47.44,4.5 U$5.P$2
N$57  (via drill 0.35)
  Top 0.305: D9.2 11.57,15.81 v11.88,16.12 | v74.11,15.93 74.11,14.07 D51.2 | v65.22,16.12 65.22,14.07 D45.2 | v56.33,16.12 56.33,14.07 D39.2 | v47.44,16.12 47.44,14.07 D33.2 | v38.55,16.12 38.55,14.07 D27.2 | v29.66,16.12 29.66,14.07 D21.2 | v20.77,16.12 20.77,14.07 D15.2 | IC1.18 v8.07,55.3 | v4.26,15.93 v6.7,15.93
  Bottom 0.305: v74.11,15.93 73.91,16.12 v65.22,16.12 v56.33,16.12 v47.44,16.12 v38.55,16.12 v29.66,16.12 v20.77,16.12 v11.88,16.12 6.9,16.12 v6.7,15.93 | v4.26,15.93 4.08,15.93 3.71,16.29 3.71,42.22 8.07,46.57 v8.07,55.3
N$58
  Top 0.305: D39.3 56.97,5.13 56.33,4.5 U$6.P$2
N$59  (via drill 0.35)
  Top 0.305: D11.2 6.49,20.69 v6.8,21.01 | D17.2 15.38,20.69 v15.69,21.01 | D23.2 24.27,20.69 v24.58,21.01 | D29.2 33.16,20.69 v33.47,21.01 | D35.2 42.05,20.69 v42.36,21.01 | D41.2 50.94,20.69 v51.25,21.01 | D47.2 59.83,20.69 v60.14,21.01 | D53.2 68.72,20.69 v69.03,21.01 | IC1.16 v10.61,55.3
  Bottom 0.305: v69.03,21.01 v60.14,21.01 v51.25,21.01 v42.36,21.01 v33.47,21.01 v24.58,21.01 v15.69,21.01 v6.8,21.01 6.78,21.01 4.86,22.92 4.86,41.61 10.61,47.36 v10.61,55.3
N$60  (via drill 0.35)
  Top 0.305: D12.2 11.57,22.16 v11.88,22.47 | D54.2 74.11,20.42 v74.11,22.28 | v65.22,22.47 65.22,20.42 D48.2 | v56.33,22.47 56.33,20.42 D42.2 | v46.81,22.47 46.81,20.42 D36.2 | v38.55,22.47 38.55,20.42 D30.2 | v29.03,22.47 29.03,20.42 D24.2 | v20.77,22.47 20.77,20.42 D18.2 | IC1.15 v11.88,54.03
  Bottom 0.305: v74.11,22.28 73.91,22.47 v65.22,22.47 v56.33,22.47 v46.81,22.47 v38.55,22.47 v29.03,22.47 v20.77,22.47 v11.88,22.47 7.21,22.47 5.49,24.19 5.49,41.29 11.88,47.68 v11.88,54.03
N$61  (via drill 0.35)
  Top 0.305: D13.2 12.27,27.16 v12.5,27.16 | D19.2 21.16,27.16 v21.39,27.16 | D25.2 30.05,27.16 v30.28,27.16 | D37.2 47.83,27.16 v48.06,27.16 | D43.2 56.72,27.16 v56.95,27.16 | D31.2 38.94,27.16 v39.17,27.16 | D49.2 65.61,27.16 v65.84,27.16 | D55.2 74.7,27.36 v74.75,27.36 | IC1.14 v13.15,54.66
  Bottom 0.305: v74.75,27.36 74.55,27.16 v65.84,27.16 v56.95,27.16 v48.06,27.16 v39.17,27.16 v30.28,27.16 v21.39,27.16 v12.5,27.16 12.41,27.07 6.84,27.07 6.07,27.85 6.07,40.92 13.15,48 v13.15,54.66
N$62  (via drill 0.35)
  Top 0.305: D14.2 6.49,28.31 v6.8,28.63 | v15.06,28.63 15.38,28.31 D20.2 | v24.58,28.63 23.95,27.99 23.95,26.77 D26.2 | D32.2 33.16,28.31 v33.47,28.63 | D38.2 42.05,28.31 v42.36,28.63 | D44.2 50.94,28.31 51.25,28.63 v51.89,28.63 | D50.2 59.83,28.31 v60.14,28.63 | D56.2 68.72,27.68 v69.67,28.63 | IC1.13 v14.42,55.3
  Bottom 0.305: v6.8,28.63 6.84,28.63 | 6.84,28.63 v15.06,28.63 v24.58,28.63 v33.47,28.63 v42.36,28.63 v51.89,28.63 v60.14,28.63 v69.67,28.63 | v14.42,55.3 14.43,55.28 14.43,48.25 6.58,40.4 6.58,28.89 6.84,28.63
N$63
  Top 0.305: D15.3 21.41,5.13 20.77,4.5 U$2.P$2
N$64
  Top 0.305: U$2.P$4 18.51,4.14 18.51,4.12 17.97,3.59 17.15,3.59 15.82,4.92 15.82,8.6 16.33,9.11 D16.3
N$65
  Top 0.305: D17.3 16.52,17.81 16.52,13.15 17.6,12.08 17.6,9.66 16.33,8.39 16.33,5.13 16.96,4.5 U$2.P$6
N$66
  Top 0.305: D18.3 19.5,16.1 19.5,9.58 20.14,8.94 U$2.P$8
N$67
  Top 0.305: D19.3 19.5,24.35 18.87,23.72 U$2.P$10
N$68
  Top 0.305: D20.3 17.6,24.35 18.23,23.72 18.23,9.58 17.6,8.94 U$2.P$12
N$69
  Top 0.305: D28.3 34.11,9.66 33.6,9.15 33.6,4.92 34.93,3.59 35.75,3.59 36.29,4.12 36.29,4.14 U$4.P$4
N$70
  Top 0.305: D22.3 25.22,9.02 24.71,8.52 24.71,4.92 26.04,3.59 26.86,3.59 27.4,4.12 27.4,4.14 U$3.P$4
N$71
  Top 0.305: D23.3 25.22,13.35 25.62,12.94 25.66,12.94 26.49,12.12 26.49,9.66 25.98,9.15 25.98,9.07 25.22,8.31 25.22,5.13 25.85,4.5 U$3.P$6
N$72
  Top 0.305: D24.3 28.39,16.73 28.39,9.58 29.03,8.94 U$3.P$8
N$73
  Top 0.305: D25.3 29.03,24.35 27.76,23.08 U$3.P$10
N$74
  Top 0.305: 25.22,24.18 D26.3 25.68,24.35 27.12,22.91 27.12,9.58 26.49,8.94 U$3.P$12
N$75
  Top 0.305: D45.3 65.86,5.13 65.22,4.5 U$7.P$2
N$76  (via drill 0.35)
  Top 0.305: D10.2 6.49,14.44 v6.7,14.66 | IC1.17 v9.34,54.66 | D46.2 59.83,14.66 v60.14,14.66 | v68.93,14.66 68.93,13.75 D52.2 | v51.15,14.66 51.15,13.75 D40.2 | v42.26,14.66 42.26,13.75 D34.2 | v33.37,14.66 33.37,13.75 D28.2 | v24.48,14.66 24.48,13.75 D22.2 | D16.2 15.38,14.66 v15.69,14.66
  Bottom 0.305: v68.93,14.66 v60.14,14.66 v51.15,14.66 v42.26,14.66 v33.37,14.66 v24.48,14.66 v15.69,14.66 v6.7,14.66 4.22,17.13 4.22,42.01 9.34,47.12 v9.34,54.66
N$77
  Top 0.305: U$8.P$2 73.84,4.86 73.85,4.86 74.75,5.75 D51.3
N$78  (via drill 0.35)
  Top 0.305: U$1.P$9 U$1.P$7 U$1.P$1 U$1.P$3 | U$1.P$9 U$1.P$11 U$1.P$5 U$1.P$3 | U$1.P$3 U$1.P$9 | D1.3 27.18,63.99 v27.38,63.79
  Bottom 0.305: v27.38,63.79 27.38,47.71 11.2,31.53 11.2,31.21 U$1.P$5
N$79  (via drill 0.35)
  Top 0.305: U$2.P$3 U$2.P$1 U$2.P$7 U$2.P$9 | U$2.P$3 U$2.P$5 U$2.P$11 | U$2.P$11 U$2.P$9 | U$2.P$3 U$2.P$9 | U$2.P$11 20.31,30.07 | D2.3 30.18,64.63 v30.18,64.41
  Bottom 0.305: v30.18,64.41 30.18,48.54 20.14,38.49 U$2.P$5
N$80
  Top 0.305: D29.3 34.11,13.35 34.51,12.94 34.55,12.94 35.38,12.12 35.38,10.21 34.11,8.94 34.11,5.13 34.74,4.5 U$4.P$6
N$81
  Top 0.305: D30.3 37.28,16.1 37.28,8.94 37.92,8.31 U$4.P$8
N$82
  Top 0.305: D3.2 34.36,66.1 29.87,61.61 29.87,60.05 28.94,59.12 28.94,57.67 IC4.16
N$83  (via drill 0.35)
  Top 0.305: D13.1 14.42,25.5 v14.42,25.45 | D55.1 76.29,26.45 76.65,26.09 v76.65,25.45 | D49.1 67.4,26.45 67.76,26.09 v67.76,25.45 | D43.1 58.28,26.09 58.87,26.09 v58.87,25.45 | D37.1 49.98,25.5 v49.98,25.45 | D31.1 41.09,25.5 v41.09,25.45 | D25.1 32.2,25.5 v32.2,25.45 | D19.1 23.31,25.5 v23.31,25.45 | Q1.14 69.23,59.27 v69.39,59.43
  Bottom 0.305: v14.42,25.45 v23.31,25.45 v32.2,25.45 v41.09,25.45 v49.98,25.45 v58.87,25.45 v67.76,25.45 v76.65,25.45 76.43,25.67 76.43,41.9 71.56,46.77 71.56,58.81 70.94,59.43 v69.39,59.43
N$84  (via drill 0.35)
  Top 0.305: D14.1 8.39,27.57 v8.71,27.89 | D38.1 43.95,27.57 v44.27,27.89 | D32.1 35.06,27.57 v35.38,27.89 | D26.1 26.17,27.57 v26.49,27.89 | D56.1 70.94,26.77 v70.94,27.99 | D50.1 62.05,26.77 v62.05,27.89 | D44.1 52.84,27.57 v53.16,27.89 | D20.1 17.28,27.57 v17.6,27.89 | Q1.13 70.5,55.83 v70.63,55.7
  Bottom 0.305: v8.71,27.89 v17.6,27.89 v26.49,27.89 v35.38,27.89 v44.27,27.89 v53.16,27.89 v62.05,27.89 70.84,27.89 | 70.84,27.89 v70.94,27.99 | v70.63,55.7 70.63,46.98 75.92,41.69 75.92,29.87 73.94,27.89 70.84,27.89
N$85
  Top 0.305: D4.2 38.27,66.28 30.35,58.36 IC4.15
N$86
  Top 0.305: D5.2 42.19,66.14 38.27,62.23 35.78,62.23 31.62,58.07 IC4.14
N$87
  Top 0.305: D6.2 46.1,66.32 41.38,61.61 36.4,61.61 32.89,58.1 IC4.13
N$88
  Top 0.305: D7.2 49.05,66.99 49.05,64.63 45.52,61.1 37.03,61.1 34.16,58.24 IC4.12
N$89
  Top 0.305: D8.2 52.9,67.23 52.9,64.72 48.77,60.59 37.65,60.59 35.43,58.38 IC4.11
N$91
  Top 0.305: D31.3 37.92,24.35 36.65,23.08 U$4.P$10
N$92
  Top 0.305: D32.3 34.57,24.35 36.01,22.91 36.01,9.58 35.38,8.94 U$4.P$12
N$93
  Top 0.508: U2.1 32.62,75.16 | 32.62,75.16 R3.1 | R1.1 41.07,77.16 37.03,73.12 32.98,73.12 32.62,73.48 32.62,75.16
N$103
  Top 0.305: D34.3 43,9.66 42.49,9.15 42.49,4.92 43.82,3.59 44.64,3.59 45.18,4.12 45.18,4.14 U$5.P$4
N$104
  Top 0.305: D35.3 43,13.35 43.4,12.94 43.44,12.94 44.27,12.12 44.27,10.21 43,8.94 43,5.13 43.63,4.5 U$5.P$6
N$105
  Top 0.305: D36.3 46.17,16.73 46.17,8.94 46.81,8.31 U$5.P$8
N$106
  Top 0.305: D37.3 46.34,24.35 45.54,23.55 U$5.P$10
N$107
  Top 0.305: D38.3 44.1,24.35 44.9,23.55 44.9,8.94 44.27,8.31 U$5.P$12
N$118
  Top 0.305: D40.3 51.89,9.02 51.38,8.52 51.38,4.92 52.71,3.59 53.53,3.59 54.07,4.12 54.07,4.14 U$6.P$4
N$119
  Top 0.305: D41.3 51.89,13.35 52.29,12.94 52.33,12.94 53.16,12.12 53.16,9.66 52.65,9.15 52.65,9.07 51.89,8.31 51.89,5.13 52.52,4.5 U$6.P$6
N$120
  Top 0.305: D42.3 55.06,16.1 55.06,9.58 55.7,8.94 U$6.P$8
N$121
  Top 0.305: 56.97,24.18 D43.3 55.7,24.35 54.43,23.08 U$6.P$10
N$122
  Top 0.305: D44.3 52.52,24.35 53.79,23.08 53.79,9.58 53.16,8.94 U$6.P$12
N$133
  Top 0.305: D46.3 60.78,9.02 60.27,8.52 60.27,4.92 61.6,3.59 62.42,3.59 62.96,4.12 62.96,4.14 U$7.P$4
N$134
  Top 0.305: D47.3 60.97,17.81 60.97,13.15 61.18,12.94 61.22,12.94 62.05,12.12 62.05,9.58 60.78,8.31 60.78,5.13 61.41,4.5 U$7.P$6
N$135
  Top 0.305: D48.3 63.95,16.1 63.95,8.31 64.59,7.67 U$7.P$8
N$136
  Top 0.305: D49.3 64.12,24.35 63.32,23.55 U$7.P$10
N$137
  Top 0.305: D50.3 61.88,24.35 62.68,23.55 62.68,8.94 62.05,8.31 U$7.P$12
N$148
  Top 0.305: U$8.P$4 71.85,4.14 71.85,4.12 71.31,3.59 70.56,3.59 69.16,4.99 69.16,8.52 69.67,9.02 D52.3
N$149
  Top 0.305: D53.3 69.67,13.35 70.07,12.94 70.11,12.94 71.06,11.99 71.06,9.58 69.79,8.31 69.67,8.31 69.67,5.75 70.56,4.86 70.58,4.86 U$8.P$6
N$150
  Top 0.305: D54.3 72.84,16.1 72.84,8.94 73.48,8.31 U$8.P$8
N$151
  Top 0.305: D55.3 73.01,24.35 72.21,23.55 U$8.P$10
N$152
  Top 0.305: U$8.P$12 70.94,8.31 71.57,8.94 71.57,23.55 70.77,24.35 D56.3
N$153  (via drill 0.35)
  Top 0.305: D9.1 13.47,16.54 v13.79,16.86 | v75.38,16.56 75.7,16.25 75.7,14.31 | 75.7,14.31 D51.1 | D45.1 66.81,16.54 v67.13,16.86 | D39.1 57.92,16.54 v58.24,16.86 | D33.1 49.03,16.54 v49.35,16.86 | D27.1 40.14,15.9 v41.09,16.86 | D21.1 31.25,16.54 v31.57,16.86 | D15.1 22.36,16.54 v22.68,16.86 | Q1.18 64.15,59.07 v64.1,59.12 | v77.16,14.31 75.7,14.31
  Bottom 0.305: v13.79,16.86 v22.68,16.86 v31.57,16.86 v41.09,16.86 v49.35,16.86 v58.24,16.86 v67.13,16.86 75.08,16.86 v75.38,16.56 | v64.1,59.12 64.61,59.63 64.61,59.73 66.56,61.69 71.56,61.69 74.36,58.88 74.36,46.84 78.49,42.71 78.49,28.33 79.31,27.51 79.31,16.46 v77.16,14.31
PIN_0  (via drill 0.35)
  Top 0.305: IC3.1 6.74,39.18 6.74,35.82 8.36,34.2 59.41,34.2 v59.74,34.54 62.88,37.67 IC2.1 | v71.25,34.54 75.61,34.54 77.26,34.54 81.62,38.89 82.77,38.89 86.81,42.94 86.81,61.61 88.12,62.92 U$9.D9
  Bottom 0.305: v71.25,34.54 v59.74,34.54
PIN_1  (via drill 0.35)
  Top 0.305: IC3.2 8.07,35.8 v8.09,35.78 | v8.71,33.29 59.84,33.29 v60.1,33.56 64.15,37.6 IC2.2 | U$9.D10 90.66,62.35 90.23,61.92 88.99,61.92 87.74,60.67 87.74,43.15 82.98,38.39 81.95,38.39 77.16,33.6 v70.32,33.6
  Bottom 0.305: v8.09,35.78 8.09,33.92 v8.71,33.29 | v60.1,33.56 70.27,33.56 v70.32,33.6
PIN_2  (via drill 0.35)
  Top 0.305: IC3.3 v9.34,35.79 v9.33,35.78 | v10.27,32.56 60.44,32.56 | IC2.3 65.42,37.53 60.44,32.56 | 60.44,32.56 75.92,32.56 76.03,32.56 76.84,32.56 82.16,37.88 83.19,37.88 89.3,43.99 89.3,58.81 91.17,60.67 92.41,60.67 93.2,61.47 U$9.D11
  Bottom 0.305: v9.33,35.78 9.33,34.33 9.45,34.22 9.45,33.38 v10.27,32.56
RAW
  Top 0.508: U2.3 32.62,79.79 C5.1
  Top 0.61: J1.PWR 15.16,79.25 18.36,82.45 27.07,82.45 | U2.3 29.24,80.29 27.07,82.45 | 27.07,82.45 58.21,82.45 U$9.RAW
RESET  (via drill 0.35)
  Top 0.305: IC3.4 10.61,40.48 12.76,42.63 30.8,42.63 31.62,41.81 IC6.6 31.62,38.7 32.05,38.27 47.92,38.27 48.77,39.12 IC5.4 48.77,41.61 v48.85,41.69 | v55.38,42 v61.92,42 | v69.07,41.38 69.23,41.23 IC2.6 69.39,39.7 69.39,38.89 69.7,38.58 75.61,38.58 76.23,39.2 76.23,59.74 75.42,60.55 U$9.D4
  Bottom 0.305: v48.85,41.69 49.16,42 v55.38,42 | v61.92,42 68.45,42 v69.07,41.38
SET  (via drill 0.35)
  Top 0.305: 51.34,38.89 50.21,37.76 30.38,37.76 29.08,39.06 IC6.4 29.08,41.35 28.63,41.81 15.05,41.81 13.15,39.91 IC3.6 | 51.34,38.89 51.34,40.14 IC5.6 | 51.34,38.89 52.27,37.96 v61.61,37.96 | IC2.4 66.59,39.76 v66.59,37.96 75.92,37.96 76.85,38.89 76.85,59.74 77.96,60.85 U$9.D5
  Bottom 0.305: v61.61,37.96 v66.59,37.96
VCC  (via drill 0.35)
  Top 0.305: IC3.16 4.93,44.69 C1.2 4.67,44.94 v4.67,46.36 | IC2.16 62.85,45.34 C2.2 60.67,45.64 v60.67,46.98 | IC6.16 23.38,45.62 | 23.38,45.62 C3.2 | IC5.16 43.07,45.62 C4.2 40.85,45.65 v39.52,46.98 | v23.34,46.98 23.38,46.93 23.38,45.62
  Bottom 0.305: J3.2 18.07,66.25 | 18.07,66.25 18.05,66.22 18.05,63.79 17.89,63.63 | 17.89,63.63 13.38,59.12 4.98,59.12 4.67,58.81 v4.67,46.36 | 17.89,63.63 23.34,58.18 v23.34,46.98 | 65.34,77.48 65.34,71.25 61.61,67.52 59.12,67.52 58.5,66.9 58.5,49.16 v60.67,46.98 | v39.52,46.98 39.52,65.03 38.3,66.25 18.07,66.25
  Bottom 0.61: J3.2 24.63,72.81 43.56,72.81 48.23,77.48 65.34,77.48 66.59,77.48 67.8,78.7 U$9.5V

### Text on the board
tNames: V_OUT | GND | Jump to power from Arduino | PIN CONTROL_SOURCE | PIN CONTROL_SINK | BRAILLE CELL EVALUATION BOAD | @vjvarada